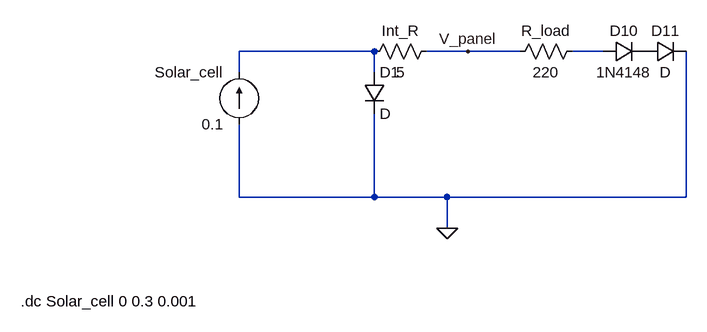
[diagram p0: schematic Draft29.asc]
Draft29.asc, the LTspice schematic file:
Version 4.1
SHEET 1 880 948
WIRE 64 80 -144 80
WIRE 208 80 144 80
WIRE 288 80 208 80
WIRE 416 80 368 80
WIRE -144 112 -144 80
WIRE 64 112 64 80
WIRE -144 304 -144 192
WIRE 64 304 64 176
WIRE 64 304 -144 304
WIRE 176 304 64 304
WIRE 544 304 544 80
WIRE 544 304 176 304
WIRE 176 352 176 304
FLAG 208 80 V_panel
FLAG 176 352 0
SYMBOL res 272 96 R270
WINDOW 0 32 56 VTop 2
WINDOW 3 0 56 VBottom 2
SYMATTR InstName R_load
SYMATTR Value 220
SYMBOL res 48 96 R270
WINDOW 0 32 56 VTop 2
WINDOW 3 0 56 VBottom 2
SYMATTR InstName Int_R
SYMATTR Value 5
SYMBOL current -144 192 R180
WINDOW 0 24 80 Left 2
WINDOW 3 24 0 Left 2
WINDOW 123 0 0 Left 0
WINDOW 39 0 0 Left 0
SYMATTR InstName Solar_cell
SYMATTR Value 0.1
SYMBOL diode 48 112 R0
SYMATTR InstName D1
SYMBOL diode 416 96 R270
WINDOW 0 32 32 VTop 2
WINDOW 3 0 32 VBottom 2
SYMATTR InstName D10
SYMATTR Value 1N4148
SYMBOL diode 480 96 R270
WINDOW 0 32 32 VTop 2
WINDOW 3 0 32 VBottom 2
SYMATTR InstName D11
TEXT -480 464 Left 2 !.dc Solar_cell 0 0.3 0.001

The netlist it stands for:
* Draft29.asc
R_load V_panel N002 220
R§Int_R N001 V_panel 5
I§Solar_cell 0 N001 0.1
D1 N001 0 D
D10 N002 P001 1N4148
D11 P001 0 D
.model D D
.lib standard.dio
.dc Solar_cell 0 0.3 0.001
.backanno
.end